# Altium project FPC_to_wires.PrjPcb
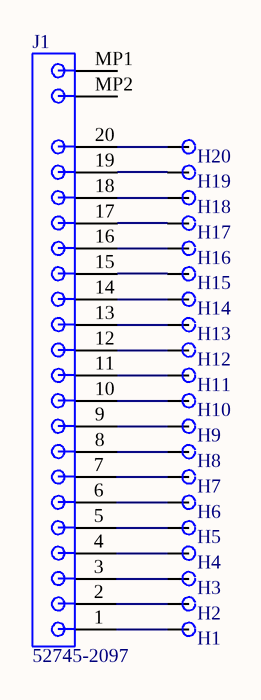
[diagram p0: FPC_to_wires.SchDoc]
1 sheet, 21 parts. Net scope: global (net labels, ports and power ports of the same name join across sheets).
Board file: FPC_to_wires.PcbDoc

## Sheet FPC_to_wires.SchDoc
size A4

### Parts
H1  PAD  [PAD]  (value not drawn)  (no BOM)
H2  PAD  [PAD]  (value not drawn)  (no BOM)
H3  PAD  [PAD]  (value not drawn)  (no BOM)
H4  PAD  [PAD]  (value not drawn)  (no BOM)
H5  PAD  [PAD]  (value not drawn)  (no BOM)
H6  PAD  [PAD]  (value not drawn)  (no BOM)
H7  PAD  [PAD]  (value not drawn)  (no BOM)
H8  PAD  [PAD]  (value not drawn)  (no BOM)
H9  PAD  [PAD]  (value not drawn)  (no BOM)
H10  PAD  [PAD]  (value not drawn)  (no BOM)
H11  PAD  [PAD]  (value not drawn)  (no BOM)
H12  PAD  [PAD]  (value not drawn)  (no BOM)
H13  PAD  [PAD]  (value not drawn)  (no BOM)
H14  PAD  [PAD]  (value not drawn)  (no BOM)
H15  PAD  [PAD]  (value not drawn)  (no BOM)
H16  PAD  [PAD]  (value not drawn)  (no BOM)
H17  PAD  [PAD]  (value not drawn)  (no BOM)
H18  PAD  [PAD]  (value not drawn)  (no BOM)
H19  PAD  [PAD]  (value not drawn)  (no BOM)
H20  PAD  [PAD]  (value not drawn)  (no BOM)
J1  52745-2097  [MOLX-52745-2097]

### Nets
NetH1_1: H1.1 J1.1
NetH2_1: H2.1 J1.2
NetH3_1: H3.1 J1.3
NetH4_1: H4.1 J1.4
NetH5_1: H5.1 J1.5
NetH6_1: H6.1 J1.6
NetH7_1: H7.1 J1.7
NetH8_1: H8.1 J1.8
NetH9_1: H9.1 J1.9
NetH10_1: H10.1 J1.10
NetH11_1: H11.1 J1.11
NetH12_1: H12.1 J1.12
NetH13_1: H13.1 J1.13
NetH14_1: H14.1 J1.14
NetH15_1: H15.1 J1.15
NetH16_1: H16.1 J1.16
NetH17_1: H17.1 J1.17
NetH18_1: H18.1 J1.18
NetH19_1: H19.1 J1.19
NetH20_1: H20.1 J1.20

Not connected (* = marked no-connect by the designer): J1 MP1 MP2

### Library data of the parts
J1 = 52745-2097: 0.5 mm Pitch Easy-On(TM) Type FPC Connector, 2.0 mm Mated Height, Right Angle, ZIF, SMT, Top Contact, 20 Circuits, -20 to 85 degC, ELV and RoHS Compliant, Tape and Reel; Manufacturer: Molex; Durability (mating cycles max): 20; Mated Height: 2.00mm; Material - Metal: Phosphor Bronze; Polarized to PCB: Yes; Voltage (Max): 50V; Entry Angle: 90degrees Angle; PCB Locator: No; Material - Plating Termination: Gold; Current (Max per Contact): 0.5A; Pitch - Mating Interface: 0.50mm; Contact Position: Top; PartNumber: 52745-2097; ComponentLink1Description: Manufacturer URL; ComponentLink2Description: Datasheet; ComponentLink3URL: http://www.molex.com/pdm_docs/sd/527452097_sd.pdf; ComponentLink3Description: Package Specification; ComponentLink1URL: http://www.molex.com/molex/index.jsp; Packing: Tape and Reel; Number of Rows: 1; ComponentLink2URL: http://www.molex.com/webdocs/datasheets/pdf/en-us/0527452097_FFC_FPC_CONNECTORS.pdf; PackageVersion: Rev. C, 07/2010; RoHS: TRUE; Material - Plating Mating: Gold; PCB Retention: Yes; Orientation: Right Angle; Circuits (Loaded): 20; Stackable: No; Mounting Technology: Surface Mount; PackageReference: 52745-2097; PackageDescription: 20-Lead FPC Connector, Pitch 0.5 mm